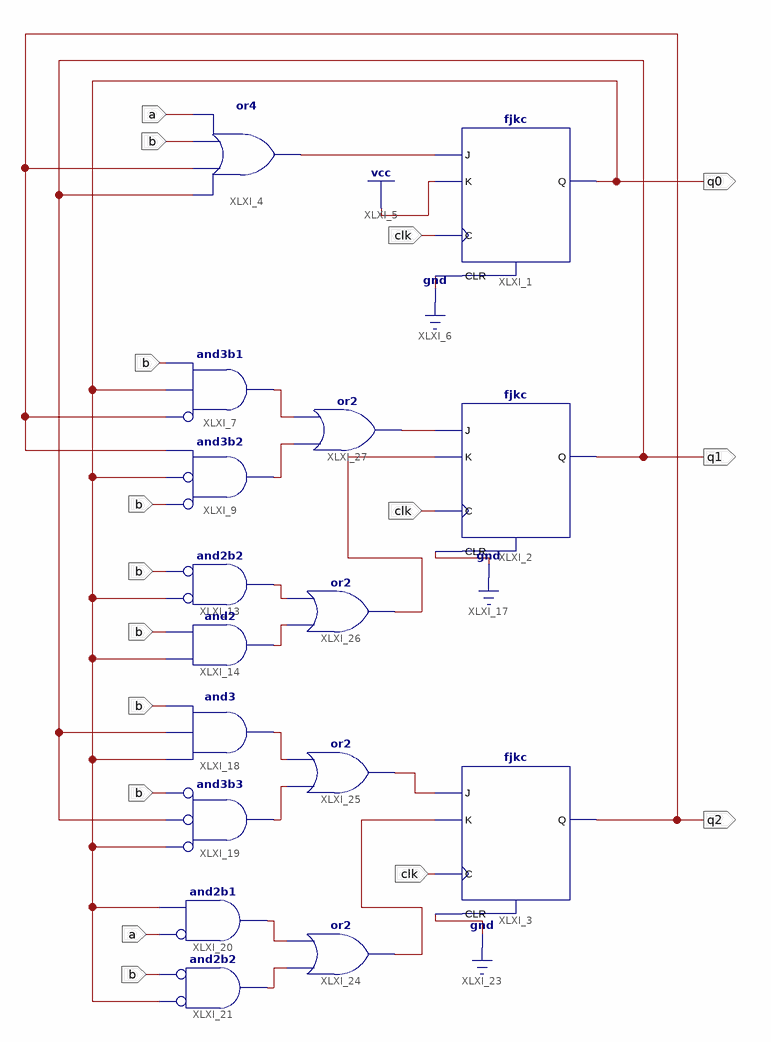
[diagram p0: schematic sheet 1]
// Xilinx ISE schematic jkflipflops.sch (spartan6) as structural Verilog: 16 symbols, 6 ports
module jkflipflops (
  input  a,
  input  b,
  input  clk,
  output q0,
  output q1,
  output q2
);

  wire XLXN_5, XLXN_40, XLXN_45, XLXN_46, XLXN_58, XLXN_59, XLXN_60, XLXN_61, XLXN_62, XLXN_63, XLXN_64,
       XLXN_65, XLXN_66;

  fjkc XLXI_3 (.C(clk), .CLR(1'b0), .J(XLXN_63), .K(XLXN_64), .Q(q2));
  or XLXI_4 (XLXN_5, q1, q2, b, a);
  and XLXI_7 (XLXN_58, ~q2, q0, b);  // and3b1
  and XLXI_9 (XLXN_59, ~b, ~q0, q2);  // and3b2
  and XLXI_13 (XLXN_60, ~q0, ~b);  // and2b2
  and XLXI_14 (XLXN_61, q0, b);
  and XLXI_18 (XLXN_45, q0, q1, b);
  and XLXI_19 (XLXN_46, ~q0, ~q1, ~b);  // and3b3
  and XLXI_20 (XLXN_65, ~a, q0);  // and2b1
  and XLXI_21 (XLXN_66, ~q0, ~b);  // and2b2
  or XLXI_24 (XLXN_64, XLXN_66, XLXN_65);
  or XLXI_25 (XLXN_63, XLXN_46, XLXN_45);
  or XLXI_26 (XLXN_62, XLXN_61, XLXN_60);
  or XLXI_27 (XLXN_40, XLXN_59, XLXN_58);
  fjkc XLXI_1 (.C(clk), .CLR(1'b0), .J(XLXN_5), .K(1'b1), .Q(q0));
  fjkc XLXI_2 (.C(clk), .CLR(1'b0), .J(XLXN_40), .K(XLXN_62), .Q(q1));
endmodule
